# EAGLE design SSB Transceiver_Buffer Amplifier (EAGLE 9.4.2)
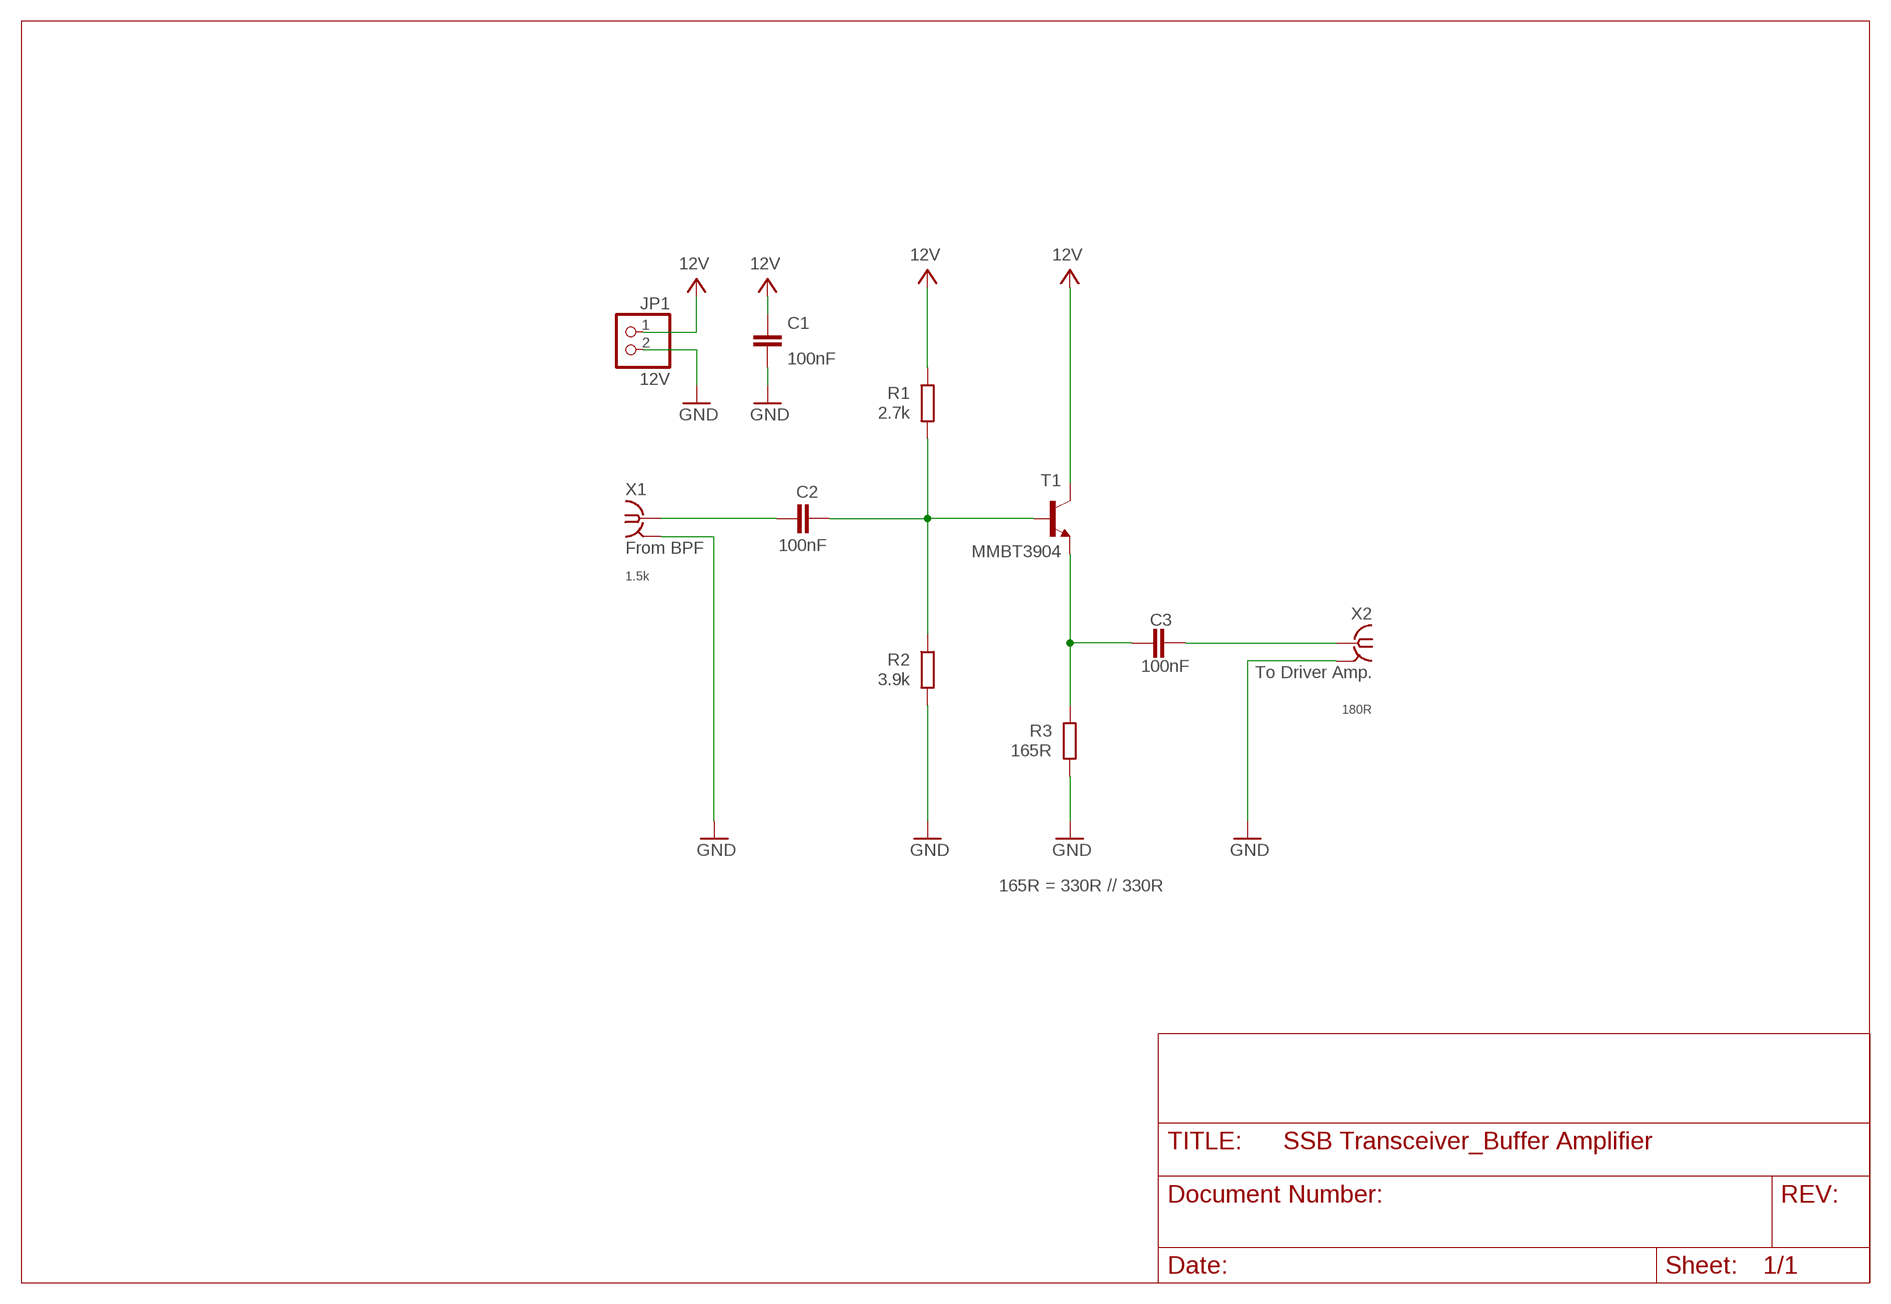
[diagram p0: schematic, sheet 1]

## Parts
C1  100nF  C-EUC0805  [C0805]
C2  100nF  C-EUC0805  [C0805]
C3  100nF  C-EUC0805  [C0805]
JP1  12V  PINHD-1X2  [1X02]
R1  2.7k  R-EU_R0805  [R0805]
R2  3.9k  R-EU_R0805  [R0805]
R3  165R  R-EU_R0805  [R0805]
T1  MMBT3904  MMBT3904LT1-NPN-SOT23-BEC  [SOT23-BEC]
X1  From BPF  SMA-PCB-CON142-0711-821/826  [J502-ND-142-0711-821/826]
X2  To Driver Amp.  SMA-PCB-CON142-0711-821/826  [J502-ND-142-0711-821/826]

## Nets
GND: C1.1 JP1.2 R2.2 R3.2 X1.G@1(GND) X1.G@2(GND) X1.G@3(GND) X1.G@4(GND) X2.G@1(GND) X2.G@2(GND) X2.G@3(GND) X2.G@4(GND)
N$1: C3.2 R3.1 T1.E
N$2: C3.1 X2.1(RF)
N$5: C2.2 R1.2 R2.1 T1.B
N$9: C2.1 X1.1(RF)
VCC: C1.2 JP1.1 R1.1 T1.C ; supply symbol labelled 12V

## Notes on the sheet
- 1.5k
- 180R
- 165R = 330R // 330R

## Library data of the parts
C1-C3 = rcl:C-EU: CAPACITOR, European symbol; SPICEPREFIX: C
JP1 = pinhead:PINHD-1X2: PIN HEADER
R1-R3 = rcl:R-EU_: RESISTOR, European symbol; SPICEPREFIX: R
T1 = transistor:*-NPN-: NPN Transistror BF959 corrected 2008.03.06
X1 X2 = Ham Radio:SMA-PCB-CON: SMA 50 Ohm End Launch Jack Receptacle - Round Contact Johnson Components Source: www.johnsoncomponents.com .. J502-ND.pdf; MF: JOHNSON COMPONENTS; MPN: 142-0711-821; OC_FARNELL: 1019328; OC_NEWARK: 16F3627

## Board
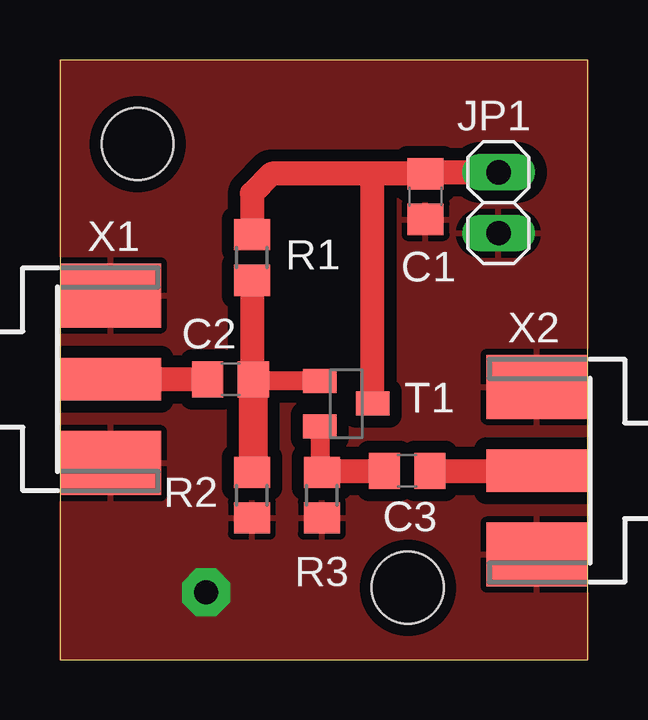
[diagram p1: board, top side]
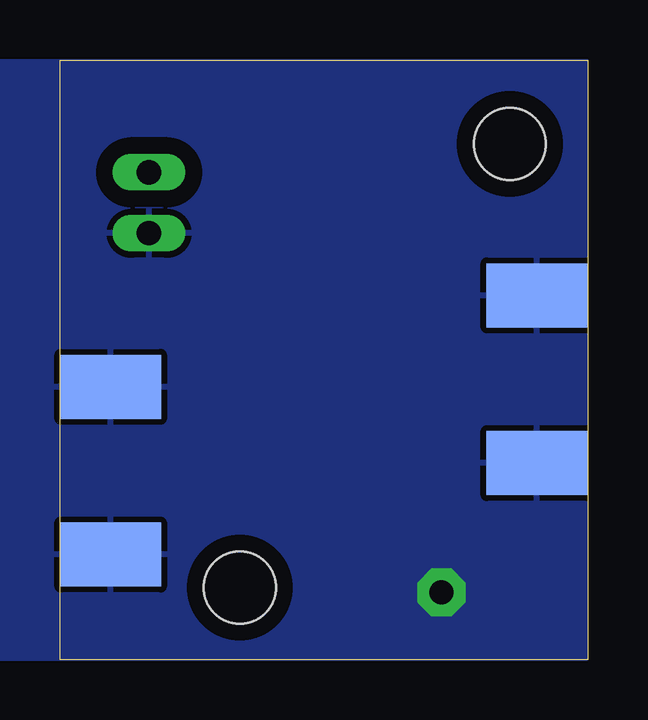
[diagram p2: board, bottom side, seen from below]

Size 22 x 25 mm. Coordinates in mm from the lower left corner, seen from the top.
Outline: 0,0 22,0 22,25 0,25 0,0
Copper layers (1*16): Top 0.035mm / dielectric 1.5mm / Bottom 0.035mm
Design rules "default *": minimum track width 6mil, minimum drill 0.35mm, track to track 20mil, track to pad 20mil, pad to pad 20mil, via to via 20mil, smd to smd 6mil, copper to edge 0mil, drill to drill 6mil, minimum pad ring 10mil, minimum via ring 8mil, stop-mask expansion 4mil, vias tented up to drill 0mil, thermal gap 10mil
Holes 3 mm at 3.24,21.5 14.5,3

### Footprints (pad centres in the part's own frame; a part is rotated, then mirrored left to right if it is on the bottom)
C0805 = smd 1.3 x 1.5: 1 -0.95,0; 2 0.95,0
1X02 = drill 1.016 long: 1 -1.27,0; 2 1.27,0
R0805 = smd 1.3 x 1.5: 1 -0.95,0; 2 0.95,0
SOT23-BEC = smd 1 x 1.4: B -0.95,-1.1; C 0,1.1; E 0.95,-1.1
J502-ND-142-0711-821/826 = smd 4.191 x 1.778: 1 2.115,0 | smd 4.191 x 2.667: G@1 2.115,3.495; G@2 2.115,-3.495 | smd 4.191 x 2.667 bottom: G@3 2.115,3.495; G@4 2.115,-3.495

### Placement (x,y rotation side)
C1  15.24,19.3 90 top
C2  7.11,11.68 0 top
C3  14.48,7.87 180 top
JP1  18.29,19.05 270 top
R1  8,16.76 270 top
R2  8,6.86 270 top
R3  10.92,6.86 270 top
T1  11.94,10.67 270 top
X1  0,11.68 0 top
X2  22,7.87 180 top

### Tracks (layer width: path | path; a pad name or v marks a point on that pad's centre or on a via)
GND  (via drill 1 pad 2)
  other vias: 6.1,2.79
  pour Top (isolate 0.5): 0,0 0,25 22,25 22,0
  pour Bottom (isolate 0.7): 0,0 0,25 39,25 39,0
N$1
  Top 0.8: T1.E 10.84,7.89 R3.1
  Top 1: R3.1 10.99,7.87 C3.2
N$2
  Top 1: C3.1 X2.1
N$5
  Top 0.8: T1.B 8.13,11.62 C2.2
  Top 1: R1.2 8,11.74 C2.2
  Top 1.2: C2.2 8.06,7.87 R2.1
N$9
  Top 1: C2.1 X1.1
VCC
  Top 1: JP1.1 15.31,20.32 C1.2 12.95,20.25 | 12.95,20.25 13.04,20.17 T1.C | R1.1 8,19.43 8.82,20.25 12.95,20.25